# EAGLE schematic bt_adapter (EAGLE 9.6.0)
ABTEILUNG: Technische Informatik; BEARBEITER: Andrej Tica; DOKUMENTART: Schaltplan; GEZ: TicA; ID: 4AHEL; STATUS: Prototyp; VER: 1.0
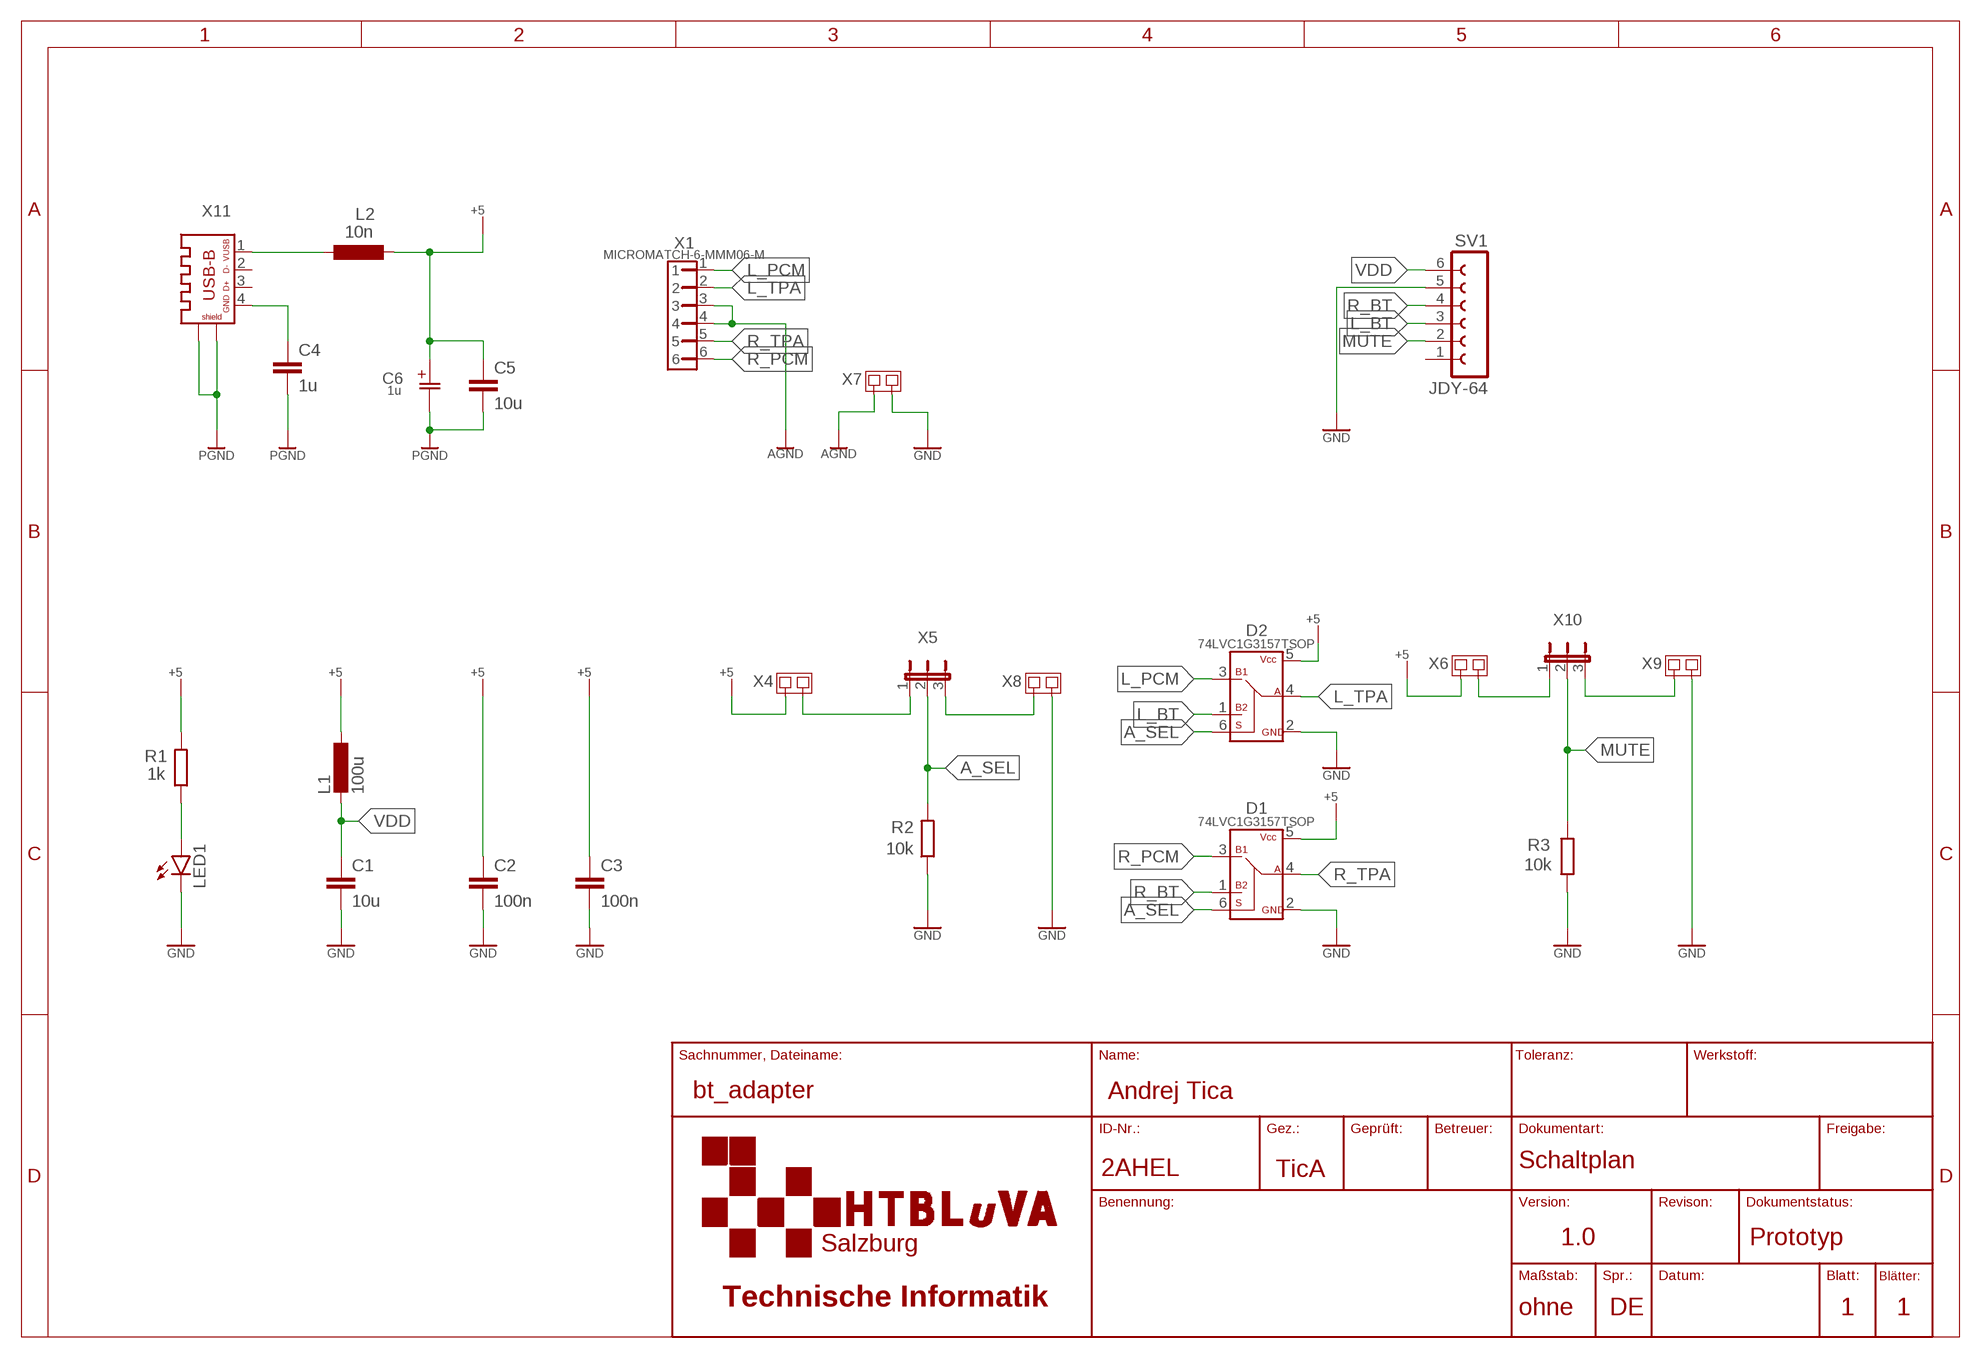
[diagram p0: schematic, sheet 1]
FRAMES1 (HTL-A4Q94): ABTEILUNG: Technische Informatik; BEARBEITER: Andrej Tica; DOKUMENTART: Schaltplan; GEZ: TicA; ID: 2AHEL; STATUS: Prototyp; VER: 1.0

## Parts
C1  10u  C-EU025-025X050  [C025-025X050]
C2  100n  C-EU025-025X050  [C025-025X050]
C3  100n  C-EU025-025X050  [C025-025X050]
C4  1u  C-EUC3216  [C3216]
C5  10u  C-EUC3216  [C3216]
C6  1u  CPOL-EU3216  [MYLIB_C3216]
D1  74LVC1G3157TSOP  [TSOP6]
D2  74LVC1G3157TSOP  [TSOP6]
L1  100u  L-EU0204/7  [0204/7]
L2  10n  L-EU0204/7  [0204/7]
LED1  LED5MM  [LED5MM]
R1  1k  R-EU_0204/7  [0204/7]
R2  10k  R-EU_0204/7  [0204/7]
R3  10k  R-EU_0204/7  [0204/7]
SV1  JDY-64  FE06-1  [FE06]
X1  MICROMATCH-6-MMM06-M  [MICROMATCH-06-W-M]
X4  JUMPSMD1FACH  [VERSTäRKER_SJ]
X5  JUMPER_JP3EJP3E  [JUMPER_JP3]
X6  JUMPSMD1FACH  [VERSTäRKER_SJ]
X7  JUMPSMD1FACH  [VERSTäRKER_SJ]
X8  JUMPSMD1FACH  [VERSTäRKER_SJ]
X9  JUMPSMD1FACH  [VERSTäRKER_SJ]
X10  JUMPER_JP3EJP3E  [JUMPER_JP3]
X11  USB-B-12411  [MYLIB_USB-B-LUM]

## Nets
+5: C2.1 C3.1 C5.1 C6.2(+) D1.5(VCC) D2.5(VCC) L1.1 L2.2 R1.2 X4.1 X6.1
A_SEL: D1.6(S) D2.6(S) R2.2 X5.2
AGND: X1.3 X1.4 X7.1
GND: C1.2 C2.2 C3.2 D1.2(GND) D2.2(GND) LED1.K(C) R2.1 R3.1 SV1.5 X7.2 X8.2 X9.2
GND1: C4.2 C5.2 C6.1(-) X11.SH@1(SH1) X11.SH@2(SH2) ; supply symbol labelled PGND
L_BT: D2.1(B2) SV1.3
L_PCM: D2.3(B1) X1.1
L_TPA: D2.4(A) X1.2
MUTE: R3.2 SV1.2 X10.2
N$1: LED1.A R1.1
N$2: C4.1 X11.4
N$3: X4.2 X5.1
N$4: X5.3 X8.1
N$5: L2.1 X11.1
N$7: X9.1 X10.3
N$9: X6.2 X10.1
R_BT: D1.1(B2) SV1.4
R_PCM: D1.3(B1) X1.6
R_TPA: D1.4(A) X1.5
VDD: C1.1 L1.2 SV1.6
Unconnected: SV1.1 X11.2 X11.3

## Library data of the parts
C1-C5 = rcl:C-EU: CAPACITOR, European symbol; SPICEPREFIX: C
C6 = RPoettinger:CPOL-EU: POLARIZED CAPACITOR, European symbol
D1 D2 = RPoettinger:74LVC1G3157
L1 L2 = rcl:L-EU: INDUCTOR, European symbol; SPICEPREFIX: L
LED1 = led:LED: LED OSRAM: - CHIPLED LG R971, LG N971, LY N971, LG Q971, LY Q971, LO R971, LY R971 LH N974, LH R974 LS Q976, LO Q976, LY Q976 LO Q996 - Hyper CHIPLED LW Q18S LB Q993, LB Q99A, LB R99A - SideLED LS A670, LO A670, LY A670, LG A670, LP A670 LB A673, LV A673, LT A673, LW A673 LH A674 LY A675 LS A676, LA A676, LO A676, LY A676, LW A676 LS A679, LY A679, LG A679 - Hyper Micro SIDELED® LS Y876, LA Y876, LO Y876, LY Y876 LT Y87S - SmartLED LW L88C, LW L88S LB L89C, LB L89S, LG L890 LS L89K, LO L89K, LY L89K LS L896, LA L896, LO L896, LY L896 - TOPLED LS T670, LO T670, LY T670, LG T670, LP T670 LSG T670, LSP T670, LSY T670, LOP T670, LYG T670 LG T671, LOG T671, LSG T671 LB T673, LV T673, LT T673, LW T673 LH T674 LS T676, LA T676, LO T676, LY T676, LB T676, LH T676, LSB T676, LW T676 LB T67C, LV T67C, LT T67C, LS T67K, LO T67K, LY T67K, LW E67C LS E67B, LA E67B, LO E67B, LY E67B, LB E67C, LV E67C, LT E67C LW T67C LS T679, LY T679, LG T679 LS T770, LO T770, LY T770, LG T770, LP T770 LB T773, LV T773, LT T773, LW T773 LH T774 LS E675, LA E675, LY E675, LS T675 LS T776, LA T776, LO T776, LY T776, LB T776 LHGB T686 LT T68C, LB T68C - Hyper Mini TOPLED® LB M676 - Mini TOPLED Santana® LG M470 LS M47K, LO M47K, LY M47K Source: http://www.osram.convergy.de LUXEON: - LUMILED® LXK2-PW12-R00, LXK2-PW12-S00, LXK2-PW14-U00, LXK2-PW14-V00 LXK2-PM12-R00, LXK2-PM12-S00, LXK2-PM14-U00 LXK2-PE12-Q00, LXK2-PE12-R00, LXK2-PE12-S00, LXK2-PE14-T00, LXK2-PE14-U00 LXK2-PB12-K00, LXK2-PB12-L00, LXK2-PB12-M00, LXK2-PB14-N00, LXK2-PB14-P00, LXK2-PB14-Q00 LXK2-PR12-L00, LXK2-PR12-M00, LXK2-PR14-Q00, LXK2-PR14-R00 LXK2-PD12-Q00, LXK2-PD12-R00, LXK2-PD12-S00 LXK2-PH12-R00, LXK2-PH12-S00 LXK2-PL12-P00, LXK2-PL12-Q00, LXK2-PL12-R00 Source: www.luxeon.com KINGBRIGHT: KA-3528ASYC Source: www.kingbright.com
R1-R3 = rcl:R-EU_: RESISTOR, European symbol; SPICEPREFIX: R
SV1 = RPoettinger:FE06-1: FEMALE HEADER; OC_FARNELL: unknown; OC_NEWARK: unknown
X1 = RPoettinger:MICROMATCH-6-M: WR-MM Female Connector without Latch and without Polarization, 6 Pins=>Code : Con_BTB_MM_Female_THT_St_690357180672 <http://katalog.we-online.de/media/thumbs2/eican/thb_Con_BTB_MM_Female_THT_St_69036718xx72_pf2.jpg> Details see: http://katalog.we-online.de/en/em/6903_6718_xx_72 Created 2014-06-04, Karrer Zheng 2014 (C) Würth Elektronik
X4 X6-X9 = RPoettinger:JUMPSMD1FACH: SMD solder JUMPER
X5 X10 = RPoettinger:JUMPER_JP3E: JUMPER
X11 = RPoettinger:USB-B-1